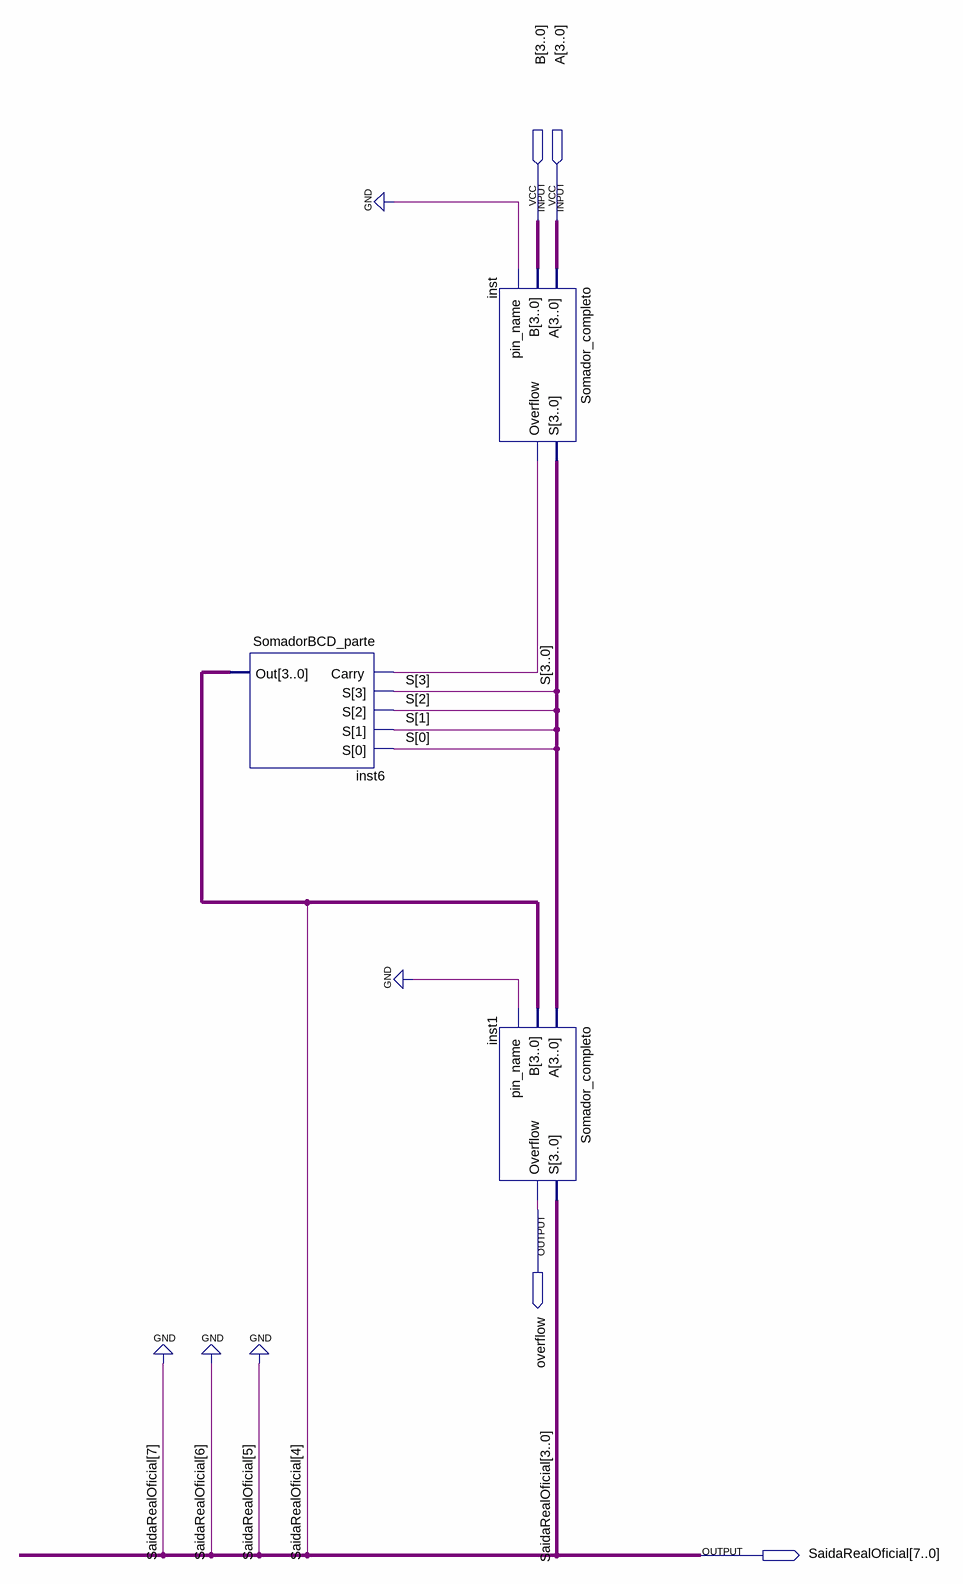
[diagram p0: schematic sheet]
// Quartus schematic SomadorBCD_completo.bdf as structural Verilog: 3 symbols, 4 pins
module SomadorBCD_completo (
  input  [3:0] B,
  input  [3:0] A,
  output overflow,
  output [7:0] SaidaRealOficial
);

  wire inst_overflow;
  wire [3:0] inst6_out, S;

  SomadorBCD_parte inst6 (.Carry(inst_overflow), .S(S), .Out(inst6_out));
  Somador_completo inst (.A(A), .B(B), .pin_name(1'b0), .S(S), .Overflow(inst_overflow));
  Somador_completo inst1 (.A(S), .B(inst6_out), .pin_name(1'b0), .S(SaidaRealOficial[3:0]), .Overflow(overflow));

  assign SaidaRealOficial[7:5] = 3'b000;
endmodule
